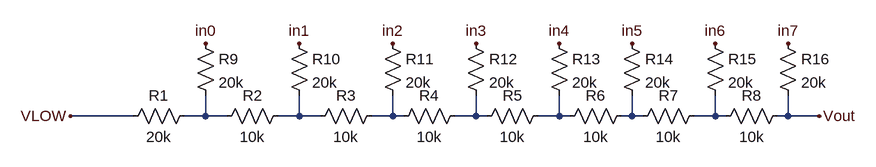
[diagram p0: schematic R2R.asc]
R2R.asc, the LTspice schematic file:
Version 4
SHEET 1 1032 680
WIRE -96 160 -192 160
WIRE 16 160 16 128
WIRE 16 160 -16 160
WIRE 48 160 16 160
WIRE 160 160 160 128
WIRE 160 160 128 160
WIRE 192 160 160 160
WIRE 304 160 304 128
WIRE 304 160 272 160
WIRE 320 160 304 160
WIRE 432 160 432 128
WIRE 432 160 400 160
WIRE 448 160 432 160
WIRE 560 160 560 128
WIRE 560 160 528 160
WIRE 576 160 560 160
WIRE 672 160 672 128
WIRE 672 160 656 160
WIRE 688 160 672 160
WIRE 800 160 800 128
WIRE 800 160 768 160
WIRE 816 160 800 160
WIRE 912 160 912 128
WIRE 912 160 896 160
WIRE 960 160 912 160
FLAG 960 160 Vout
FLAG -192 160 VLOW
FLAG 16 48 in0
FLAG 160 48 in1
FLAG 304 48 in2
FLAG 432 48 in3
FLAG 560 48 in4
FLAG 672 48 in5
FLAG 800 48 in6
FLAG 912 48 in7
SYMBOL res 0 144 R90
WINDOW 0 0 56 VBottom 2
WINDOW 3 32 56 VTop 2
SYMATTR InstName R1
SYMATTR Value 20k
SYMBOL res 144 144 R90
WINDOW 0 0 56 VBottom 2
WINDOW 3 32 56 VTop 2
SYMATTR InstName R2
SYMATTR Value 10k
SYMBOL res 288 144 R90
WINDOW 0 0 56 VBottom 2
WINDOW 3 32 56 VTop 2
SYMATTR InstName R3
SYMATTR Value 10k
SYMBOL res 416 144 R90
WINDOW 0 0 56 VBottom 2
WINDOW 3 32 56 VTop 2
SYMATTR InstName R4
SYMATTR Value 10k
SYMBOL res 544 144 R90
WINDOW 0 0 56 VBottom 2
WINDOW 3 32 56 VTop 2
SYMATTR InstName R5
SYMATTR Value 10k
SYMBOL res 672 144 R90
WINDOW 0 0 56 VBottom 2
WINDOW 3 32 56 VTop 2
SYMATTR InstName R6
SYMATTR Value 10k
SYMBOL res 784 144 R90
WINDOW 0 0 56 VBottom 2
WINDOW 3 32 56 VTop 2
SYMATTR InstName R7
SYMATTR Value 10k
SYMBOL res 912 144 R90
WINDOW 0 0 56 VBottom 2
WINDOW 3 32 56 VTop 2
SYMATTR InstName R8
SYMATTR Value 10k
SYMBOL res 0 32 R0
SYMATTR InstName R9
SYMATTR Value 20k
SYMBOL res 144 32 R0
SYMATTR InstName R10
SYMATTR Value 20k
SYMBOL res 288 32 R0
SYMATTR InstName R11
SYMATTR Value 20k
SYMBOL res 416 32 R0
SYMATTR InstName R12
SYMATTR Value 20k
SYMBOL res 544 32 R0
SYMATTR InstName R13
SYMATTR Value 20k
SYMBOL res 656 32 R0
SYMATTR InstName R14
SYMATTR Value 20k
SYMBOL res 784 32 R0
SYMATTR InstName R15
SYMATTR Value 20k
SYMBOL res 896 32 R0
SYMATTR InstName R16
SYMATTR Value 20k

The netlist it stands for:
* R2R.asc
R1 N001 VLOW 20k
R2 N002 N001 10k
R3 N003 N002 10k
R4 N004 N003 10k
R5 N005 N004 10k
R6 N006 N005 10k
R7 N007 N006 10k
R8 Vout N007 10k
R9 in0 N001 20k
R10 in1 N002 20k
R11 in2 N003 20k
R12 in3 N004 20k
R13 in4 N005 20k
R14 in5 N006 20k
R15 in6 N007 20k
R16 in7 Vout 20k
.backanno
.end